# Altium project WiWi_USBStick.PrjPcb (part 4 of 5)

## Sheet 16-ECP5_FPGA_1.SchDoc
size C; SheetNumber: 11; SheetTotal: 14
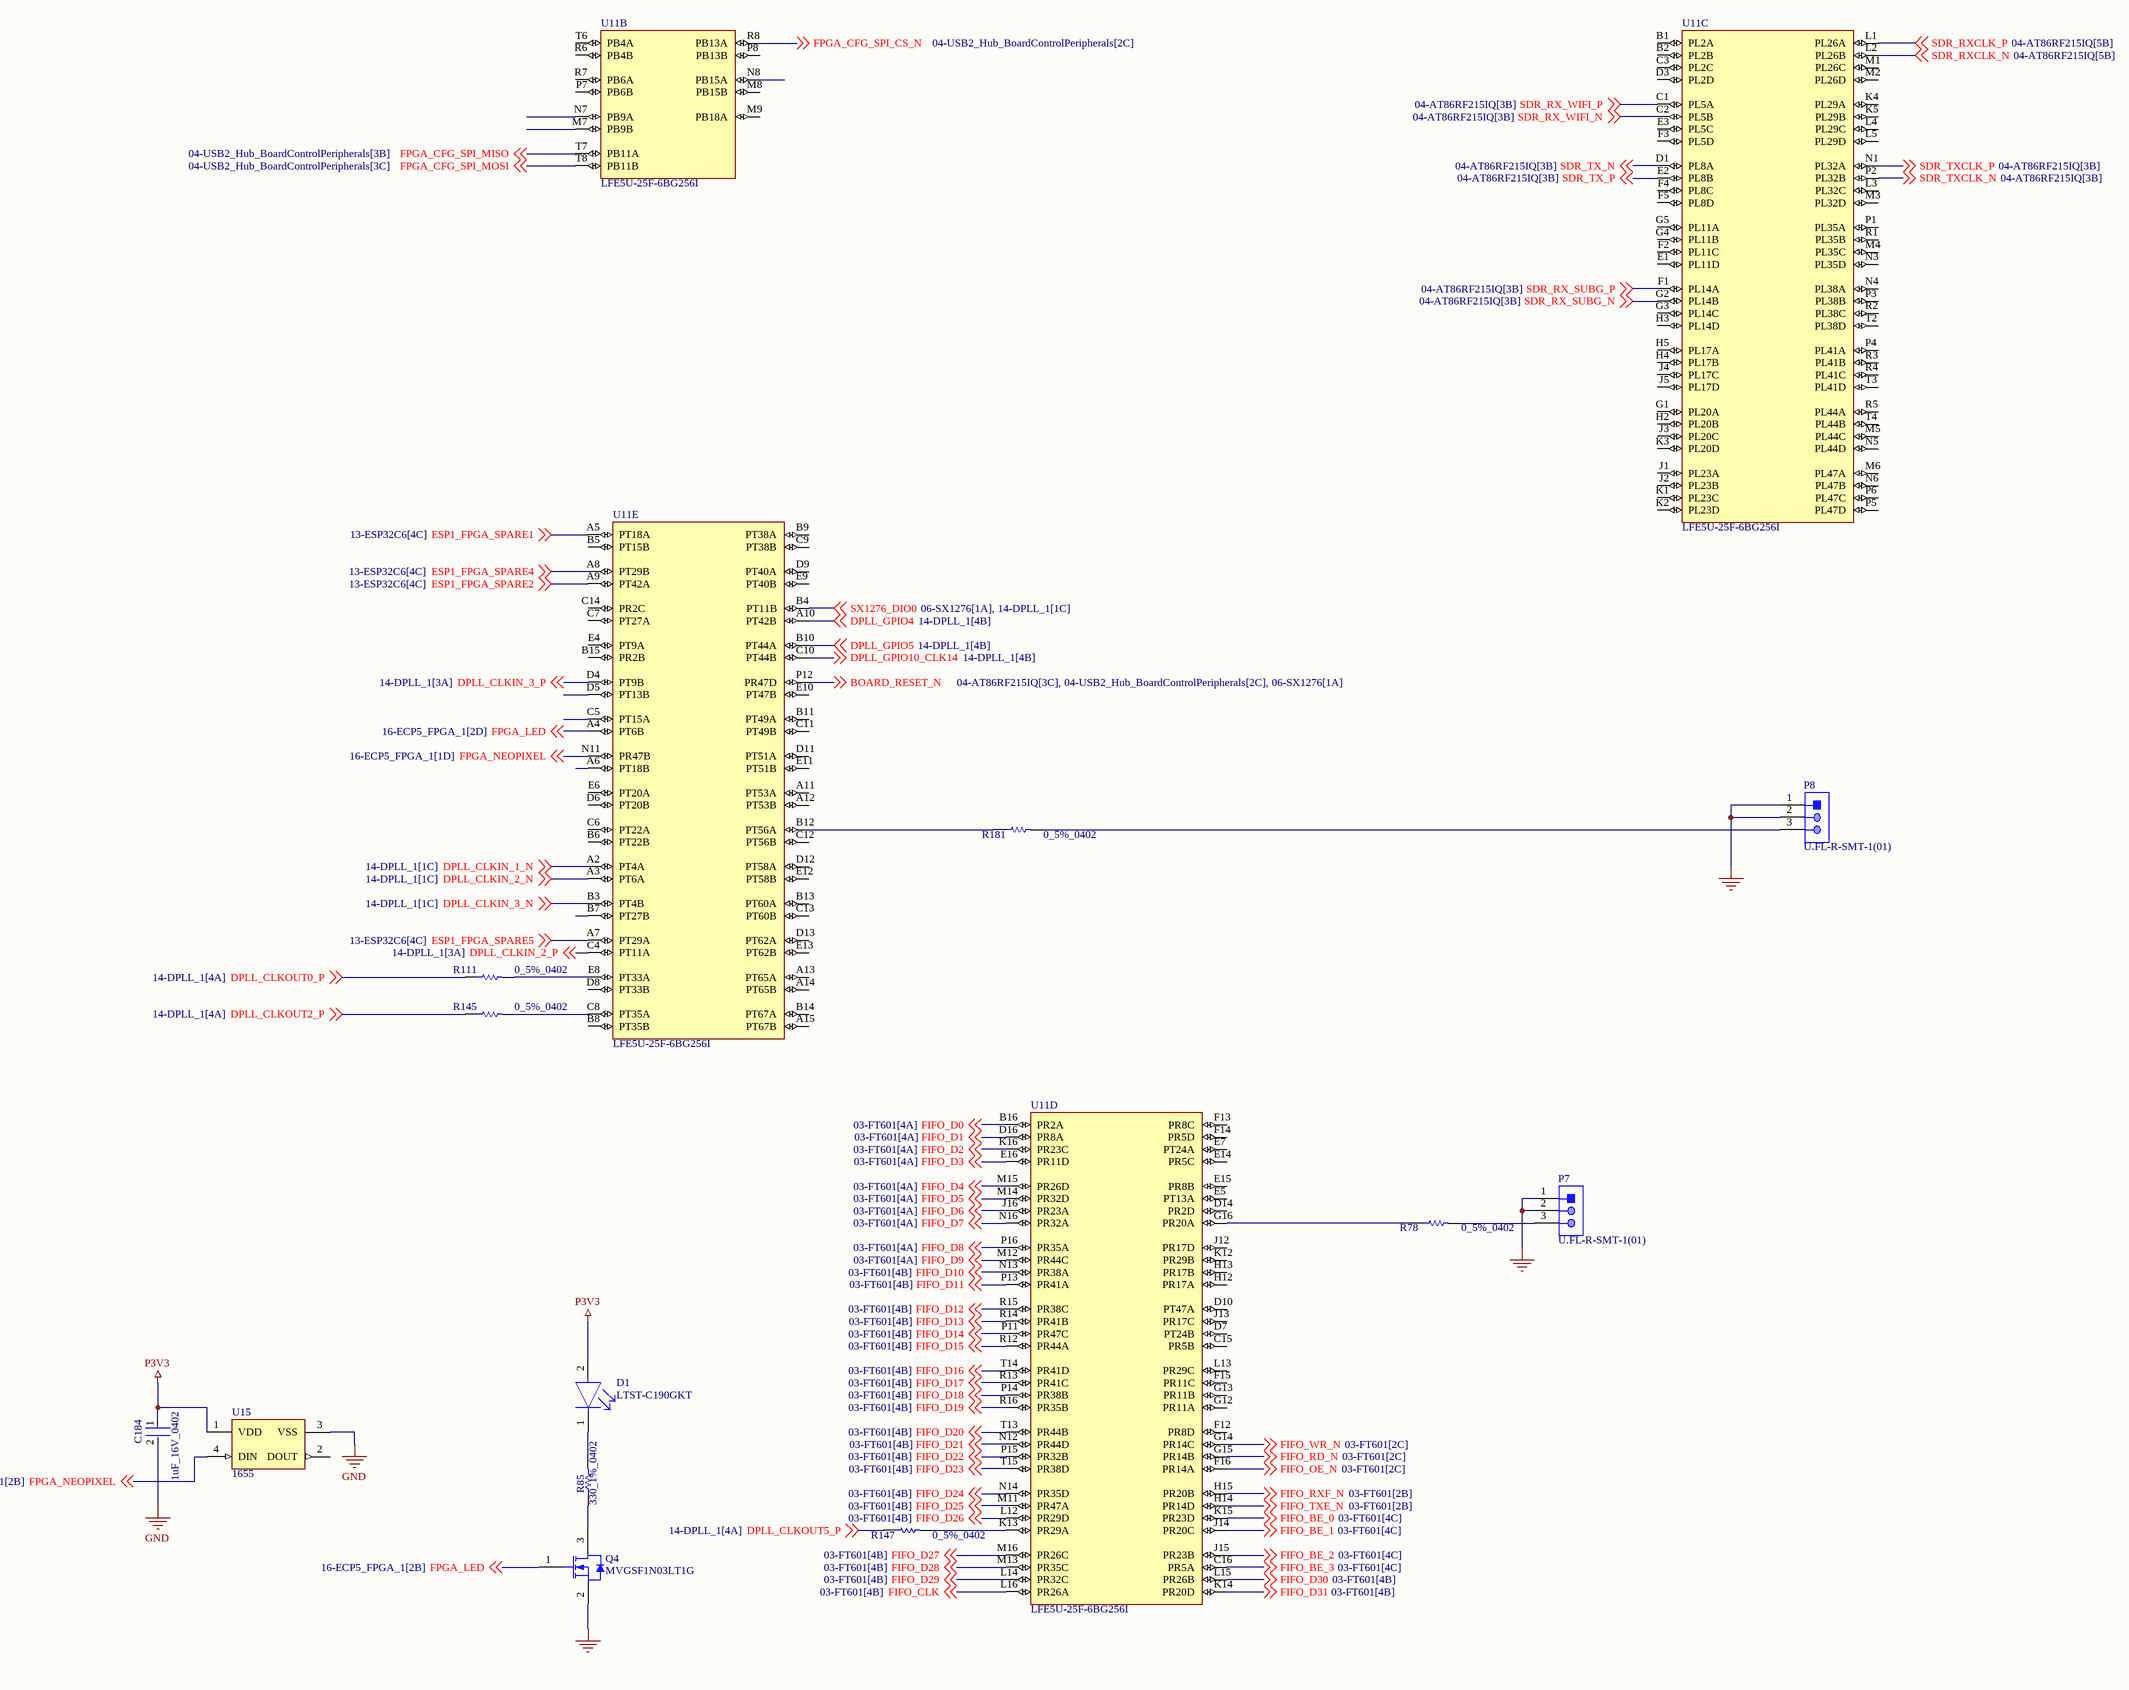
[diagram p10: 16-ECP5_FPGA_1.SchDoc]

### Parts
C184  1uF_16V_0402  [FP-0402-L_1_0_0_05-W_0_5-IPC_A]
D1  LTST-C190GKT  [FP-LTST-C190GKT-MFG]
P7  U.FL-R-SMT-1(01)  [HRS-U.FL-R-SMT-3_V]
P8  U.FL-R-SMT-1(01)  [HRS-U.FL-R-SMT-3_V]
Q4  MVGSF1N03LT1G  [ONSC-SOT-23-3-318-08_V]
R78  0_5%_0402  [RESC1005X40X25NL05T10]
R85  330_1%_0402  [RESC1005X40X25NL10T10]
R111  0_5%_0402  [RESC1005X40X25NL05T10]
R145  0_5%_0402  [RESC1005X40X25NL05T10]
R147  0_5%_0402  [RESC1005X40X25NL05T10]
R181  0_5%_0402  [RESC1005X40X25NL05T10]
U11  LFE5U-25F-6BG256I  [FP-LFE5U-25F-6BG256I-MFG]  (parts B,C,D,E of 5)
U15  1655  [ADA-RGB-1655_V]

### Nets
GND: C184.2 P7.1 P7.2 P8.1 P8.2 Q4.2(S) U15.3(VSS)
P3V3: C184.1 D1.2(A) U15.1(VDD)
BOARD_RESET_N: U11.P12(PR47D) ; off-sheet BOARD_RESET_N
DPLL_CLKIN_1_N: U11.A2(PT4A) ; off-sheet DPLL_CLKIN_1_N
DPLL_CLKIN_2_N: U11.A3(PT6A) ; off-sheet DPLL_CLKIN_2_N
DPLL_CLKIN_2_P: U11.C4(PT11A) ; off-sheet DPLL_CLKIN_2_P
DPLL_CLKIN_3_N: U11.B3(PT4B) ; off-sheet DPLL_CLKIN_3_N
DPLL_CLKIN_3_P: U11.D4(PT9B) ; off-sheet DPLL_CLKIN_3_P
DPLL_CLKOUT0_P: R111.1 ; off-sheet DPLL_CLKOUT0_P
DPLL_CLKOUT2_P: R145.1 ; off-sheet DPLL_CLKOUT2_P
DPLL_CLKOUT5_P: R147.1 ; off-sheet DPLL_CLKOUT5_P
DPLL_GPIO4: U11.A10(PT42B) ; off-sheet DPLL_GPIO4
DPLL_GPIO5: U11.B10(PT44A) ; off-sheet DPLL_GPIO5
DPLL_GPIO10_CLK14: U11.C10(PT44B) ; off-sheet DPLL_GPIO10_CLK14
ESP1_FPGA_SPARE1: U11.A5(PT18A) ; off-sheet ESP1_FPGA_SPARE1
ESP1_FPGA_SPARE2: U11.A9(PT42A) ; off-sheet ESP1_FPGA_SPARE2
ESP1_FPGA_SPARE4: U11.A8(PT29B) ; off-sheet ESP1_FPGA_SPARE4
ESP1_FPGA_SPARE5: U11.A7(PT29A) ; off-sheet ESP1_FPGA_SPARE5
FIFO_BE_0: U11.K15(PR23D) ; off-sheet FIFO_BE_0
FIFO_BE_1: U11.J14(PR20C) ; off-sheet FIFO_BE_1
FIFO_BE_2: U11.J15(PR23B) ; off-sheet FIFO_BE_2
FIFO_BE_3: U11.C16(PR5A) ; off-sheet FIFO_BE_3
FIFO_CLK: U11.L16(PR26A) ; off-sheet FIFO_CLK
FIFO_D0: U11.B16(PR2A) ; off-sheet FIFO_D0
FIFO_D1: U11.D16(PR8A) ; off-sheet FIFO_D1
FIFO_D2: U11.K16(PR23C) ; off-sheet FIFO_D2
FIFO_D3: U11.E16(PR11D) ; off-sheet FIFO_D3
FIFO_D4: U11.M15(PR26D) ; off-sheet FIFO_D4
FIFO_D5: U11.M14(PR32D) ; off-sheet FIFO_D5
FIFO_D6: U11.J16(PR23A) ; off-sheet FIFO_D6
FIFO_D7: U11.N16(PR32A) ; off-sheet FIFO_D7
FIFO_D8: U11.P16(PR35A) ; off-sheet FIFO_D8
FIFO_D9: U11.M12(PR44C) ; off-sheet FIFO_D9
FIFO_D10: U11.N13(PR38A) ; off-sheet FIFO_D10
FIFO_D11: U11.P13(PR41A) ; off-sheet FIFO_D11
FIFO_D12: U11.R15(PR38C) ; off-sheet FIFO_D12
FIFO_D13: U11.R14(PR41B) ; off-sheet FIFO_D13
FIFO_D14: U11.P11(PR47C) ; off-sheet FIFO_D14
FIFO_D15: U11.R12(PR44A) ; off-sheet FIFO_D15
FIFO_D16: U11.T14(PR41D) ; off-sheet FIFO_D16
FIFO_D17: U11.R13(PR41C) ; off-sheet FIFO_D17
FIFO_D18: U11.P14(PR38B) ; off-sheet FIFO_D18
FIFO_D19: U11.R16(PR35B) ; off-sheet FIFO_D19
FIFO_D20: U11.T13(PR44B) ; off-sheet FIFO_D20
FIFO_D21: U11.N12(PR44D) ; off-sheet FIFO_D21
FIFO_D22: U11.P15(PR32B) ; off-sheet FIFO_D22
FIFO_D23: U11.T15(PR38D) ; off-sheet FIFO_D23
FIFO_D24: U11.N14(PR35D) ; off-sheet FIFO_D24
FIFO_D25: U11.M11(PR47A) ; off-sheet FIFO_D25
FIFO_D26: U11.L12(PR29D) ; off-sheet FIFO_D26
FIFO_D27: U11.M16(PR26C) ; off-sheet FIFO_D27
FIFO_D28: U11.M13(PR35C) ; off-sheet FIFO_D28
FIFO_D29: U11.L14(PR32C) ; off-sheet FIFO_D29
FIFO_D30: U11.L15(PR26B) ; off-sheet FIFO_D30
FIFO_D31: U11.K14(PR20D) ; off-sheet FIFO_D31
FIFO_OE_N: U11.F16(PR14A) ; off-sheet FIFO_OE_N
FIFO_RD_N: U11.G15(PR14B) ; off-sheet FIFO_RD_N
FIFO_RXF_N: U11.H15(PR20B) ; off-sheet FIFO_RXF_N
FIFO_TXE_N: U11.H14(PR14D) ; off-sheet FIFO_TXE_N
FIFO_WR_N: U11.G14(PR14C) ; off-sheet FIFO_WR_N
FPGA_CFG_SPI_CS_N: U11.R8(PB13A) ; off-sheet FPGA_CFG_SPI_CS_N
FPGA_CFG_SPI_MISO: U11.T7(PB11A) ; off-sheet FPGA_CFG_SPI_MISO
FPGA_CFG_SPI_MOSI: U11.T8(PB11B) ; off-sheet FPGA_CFG_SPI_MOSI
FPGA_LED: Q4.1(G) U11.A4(PT6B) ; off-sheet FPGA_LED
FPGA_NEOPIXEL: U11.N11(PR47B) U15.4(DIN) ; off-sheet FPGA_NEOPIXEL
SDR_RX_SUBG_N: U11.G2(PL14B) ; off-sheet SDR_RX_SUBG_N
SDR_RX_SUBG_P: U11.F1(PL14A) ; off-sheet SDR_RX_SUBG_P
SDR_RX_WIFI_N: U11.C2(PL5B) ; off-sheet SDR_RX_WIFI_N
SDR_RX_WIFI_P: U11.C1(PL5A) ; off-sheet SDR_RX_WIFI_P
SDR_RXCLK_N: U11.L2(PL26B) ; off-sheet SDR_RXCLK_N
SDR_RXCLK_P: U11.L1(PL26A) ; off-sheet SDR_RXCLK_P
SDR_TX_N: U11.D1(PL8A) ; off-sheet SDR_TX_N
SDR_TX_P: U11.E2(PL8B) ; off-sheet SDR_TX_P
SDR_TXCLK_N: U11.P2(PL32B) ; off-sheet SDR_TXCLK_N
SDR_TXCLK_P: U11.N1(PL32A) ; off-sheet SDR_TXCLK_P
SX1276_DIO0: U11.B4(PT11B) ; off-sheet SX1276_DIO0
NetD1_1: D1.1(C) R85.2
NetP7_3: P7.3 R78.2
NetP8_3: P8.3 R181.2
NetQ4_3: Q4.3(D) R85.1
NetR78_1: R78.1 U11.G16(PR20A)
NetR111_2: R111.2 U11.E8(PT33A)
NetR145_2: R145.2 U11.C8(PT35A)
NetR147_2: R147.2 U11.K13(PR29A)
NetR181_1: R181.1 U11.B12(PT56A)

Not connected (* = marked no-connect by the designer): U11 A6(PT18B) A11(PT53A) A12(PT53B) A13(PT65A) A14(PT65B) A15(PT67B) B1(PL2A) B2(PL2B) B5(PT15B) B6(PT22B) B7(PT27B) B8(PT35B) B9(PT38A) B11(PT49A) B13(PT60A) B14(PT67A) B15(PR2B) C3(PL2C) C5(PT15A) C6(PT22A) C7(PT27A) C9(PT38B) C11(PT49B) C12(PT56B) C13(PT60B) C14(PR2C) C15(PR5B) D3(PL2D) D5(PT13B) D6(PT20B) D7(PT24B) D8(PT33B) D9(PT40A) D10(PT47A) D11(PT51A) D12(PT58A) D13(PT62A) D14(PR2D) E1(PL11D) E3(PL5C) E4(PT9A) E5(PT13A) E6(PT20A) E7(PT24A) E9(PT40B) E10(PT47B) E11(PT51B) E12(PT58B) E13(PT62B) E14(PR5C) E15(PR8B) F2(PL11C) F3(PL5D) F4(PL8C) F5(PL8D) F12(PR8D) F13(PR8C) F14(PR5D) F15(PR11C) G1(PL20A) G3(PL14C) G4(PL11B) G5(PL11A) G12(PR11A) G13(PR11B) H2(PL20B) H3(PL14D) H4(PL17B) H5(PL17A) H12(PR17A) H13(PR17B) J1(PL23A) J2(PL23B) J3(PL20C) J4(PL17C) J5(PL17D) J12(PR17D) J13(PR17C) K1(PL23C) K2(PL23D) K3(PL20D) K4(PL29A) K5(PL29B) K12(PR29B) L3(PL32C) L4(PL29C) L5(PL29D) L13(PR29C) M1(PL26C) M2(PL26D) M3(PL32D) M4(PL35C) M5(PL44C) M6(PL47A) M7(PB9B) M8(PB15B) M9(PB18A) N3(PL35D) N4(PL38A) N5(PL44D) N6(PL47B) N7(PB9A) N8(PB15A) P1(PL35A) P3(PL38B) P4(PL41A) P5(PL47D) P6(PL47C) P7(PB6B) P8(PB13B) R1(PL35B) R2(PL38C) R3(PL41B) R4(PL41C) R5(PL44A) R6(PB4B) R7(PB6A) T2(PL38D) T3(PL41D) T4(PL44B) T6(PB4A); U15 2(DOUT)

### Library data of the parts
C184 = CMP-14477-000104-2: as C301 on sheet 13-ESP32C6; Packaging: Tape and Reel; Depth: 0.5mm; Mount: Surface Mount; Thickness: 0.022inch; Package Quantity: 1; Min Operating Temperature: -55°C; Series: M; Voltage Rating (DC): 16V; Termination: SMD/SMT; Case/Package: 0402; Number of Pins: 2; Case Code (Imperial): 0402; Length: 1mm; Halogen Free: Halogen Free; Case Code (Metric): 1005; Width: 0.02inch; RoHS Compliant: Yes; Radiation Hardening: No; Max Operating Temperature: 85°C; Height: 0.5mm; Construction: Flat
D1 = CMP-22017-000005-2: as D4 on sheet 14-DPLL_1; Min Operating Temperature: -55°C; Lens Style: Clear; Mount: Surface Mount; Width: 0.8mm; Packaging: Tape and Reel; Lens Transparency: Clear; Case Code (Metric): 1608; Depth: 0.8mm; Case Code (Imperial): 0603; Case/Package: 0603; Number of Pins: 2; Max Operating Temperature: 85°C; Lead Free: Lead Free; Number of Elements: 1; Length: 1.6mm; Height: 0.8mm; Package Quantity: 1; Power Rating: 100mW; Radiation Hardening: No; Illumination Color: Green; Color: Green
P7 P8 = CMP-2000-05153-1: Ultra Small Coaxial Connector, 6 GHz, -40 to 90 degC, 3-Pin SMD, RoHS, Bulk; Manufacturer: Hirose Electric; Connector Style: U.FL; Impedance: 50Ohm; Dielectric Material: LiquidCrystalPolymer(LCP); Minimum Quantity: UltraMiniatureCoaxial; Online Catalog: U.FLSeries; Featured Product: HiroseU.FLSeries; Frequency - Max: 6GHz; Other Names: H122041 / U.FL-R-SMT-1(01)-ND; Contact Termination: Solder; Body Material: PhosphorBronze; Connector Type: Jack,MalePin; Body Finish: Silver; Center Contact Plating: Gold; Manufacturer URL: https://www.hirose.com; Family: CoaxialConnectors(RF); Fastening Type: Snap-On; Unit PriceUSD: U.FL; Series: U.FL; Package Reference: U.FL-R-SMT; Packaging: Bulk; Standard Package: 100; Mounting Type: SurfaceMount; Quantity Available: Bulk; Housing Color: Silver; Package Description: 3-Pin Surface Mount Device, Body 2.6 x 2.6 mm; Category: Connectors,Interconnects; Operating Temperature: -40degC~90degC; Center Contact Material: PhosphorBronze; Dynamic Catalog: U.FLSeries; Datasheet URL: https://datasheet.ciiva.com/26945/getdatasheetpartid-475239-26945414.pdf; Datasheet Version: Feb-09; Shield Termination: Solder
Q4 = CMP-1058-00779-1: Power MOSFET, 30 V, 2.1 A, Single N-Channel, 3-Pin SOT-23, Pb-Free, Tape and Reel; Manufacturer: On Semiconductor; V(BR)DSS Min (V): 30; VGS(th) Max (V): 2.4; Ciss Typ (pF): 140; VGS Max (V): 20; Channel Polarity: N Channel; ID Max (A): 2.1; Coss Typ (pF): 100; Crss Typ (pF): 40; ComponentLink3URL: http://www.onsemi.cn/pub_link/Collateral/318-08.PDF; Configuration: Single; PackageDescription: 3-Pin Small Outline Transistor, Body 2.92 x 1.3 mm, Pitch 0.95 mm; Packing: Tape and Reel; PartNumber: MVGSF1N03LT1G; ComponentLink2URL: http://www.onsemi.cn/pub_link/Collateral/MGSF1N03LT1-D.PDF; PackageVersion: Rev. AP, 11/2009; ComponentLink3Description: Package Specification; Package Type: SOT-23-3; ComponentLink1Description: Manufacturer URL; DatasheetVersion: Rev. 10; PackageReference: SOT-23-3-318-08; ComponentLink2Description: Datasheet; ComponentLink1URL: http://www.onsemi.com/; RoHS: Pb-Free; Mounting Technology: Surface Mount
R78 R111 R145 R147 R181 = CMP-2002-06457-1: as R137-R141 on sheet 13-ESP32C6
R85 = CMP-2002-05853-1: as R182 on sheet 14-DPLL_1
U11 = CMP-17932-000009-1: IC FPGA 197 I/O 256CABGA; RAM Size: 1032192b; Number of Logic Elements/Cells: 24000; Number of Logic Blocks (LABs): 6000; Number of I/Os: 197; Number of Pins: 256; Mount: Surface Mount; Max Operating Temperature: 100°C; RoHS Compliant: Yes; Min Operating Temperature: -40°C
U15 = CMP-2000-05026-1: as U27 on sheet 13-ESP32C6; Datasheet URL: http://datasheet.octopart.com/ADA1655-Adafruit-Industries-datasheet-32028139.pdf; Series: Neopixel; Interface: -; Package Description: 4-Pin Surface Mount Device, Body 5 x 5 mm; Color: Red,Green,Blue(RGB); Category: Optoelectronics; Controller Type: -; Package Reference: 1655; Manufacturer URL: https://www.adafruit.com/; Mounting Type: SurfaceMount; Datasheet Version: May-13; Size / Dimension: 5.00mmLx5.00mmW; Family: Addressable,Specialty

## Sheet 17-ECP5_FPGA_2.SchDoc
size B; SheetNumber: 12; SheetTotal: 14
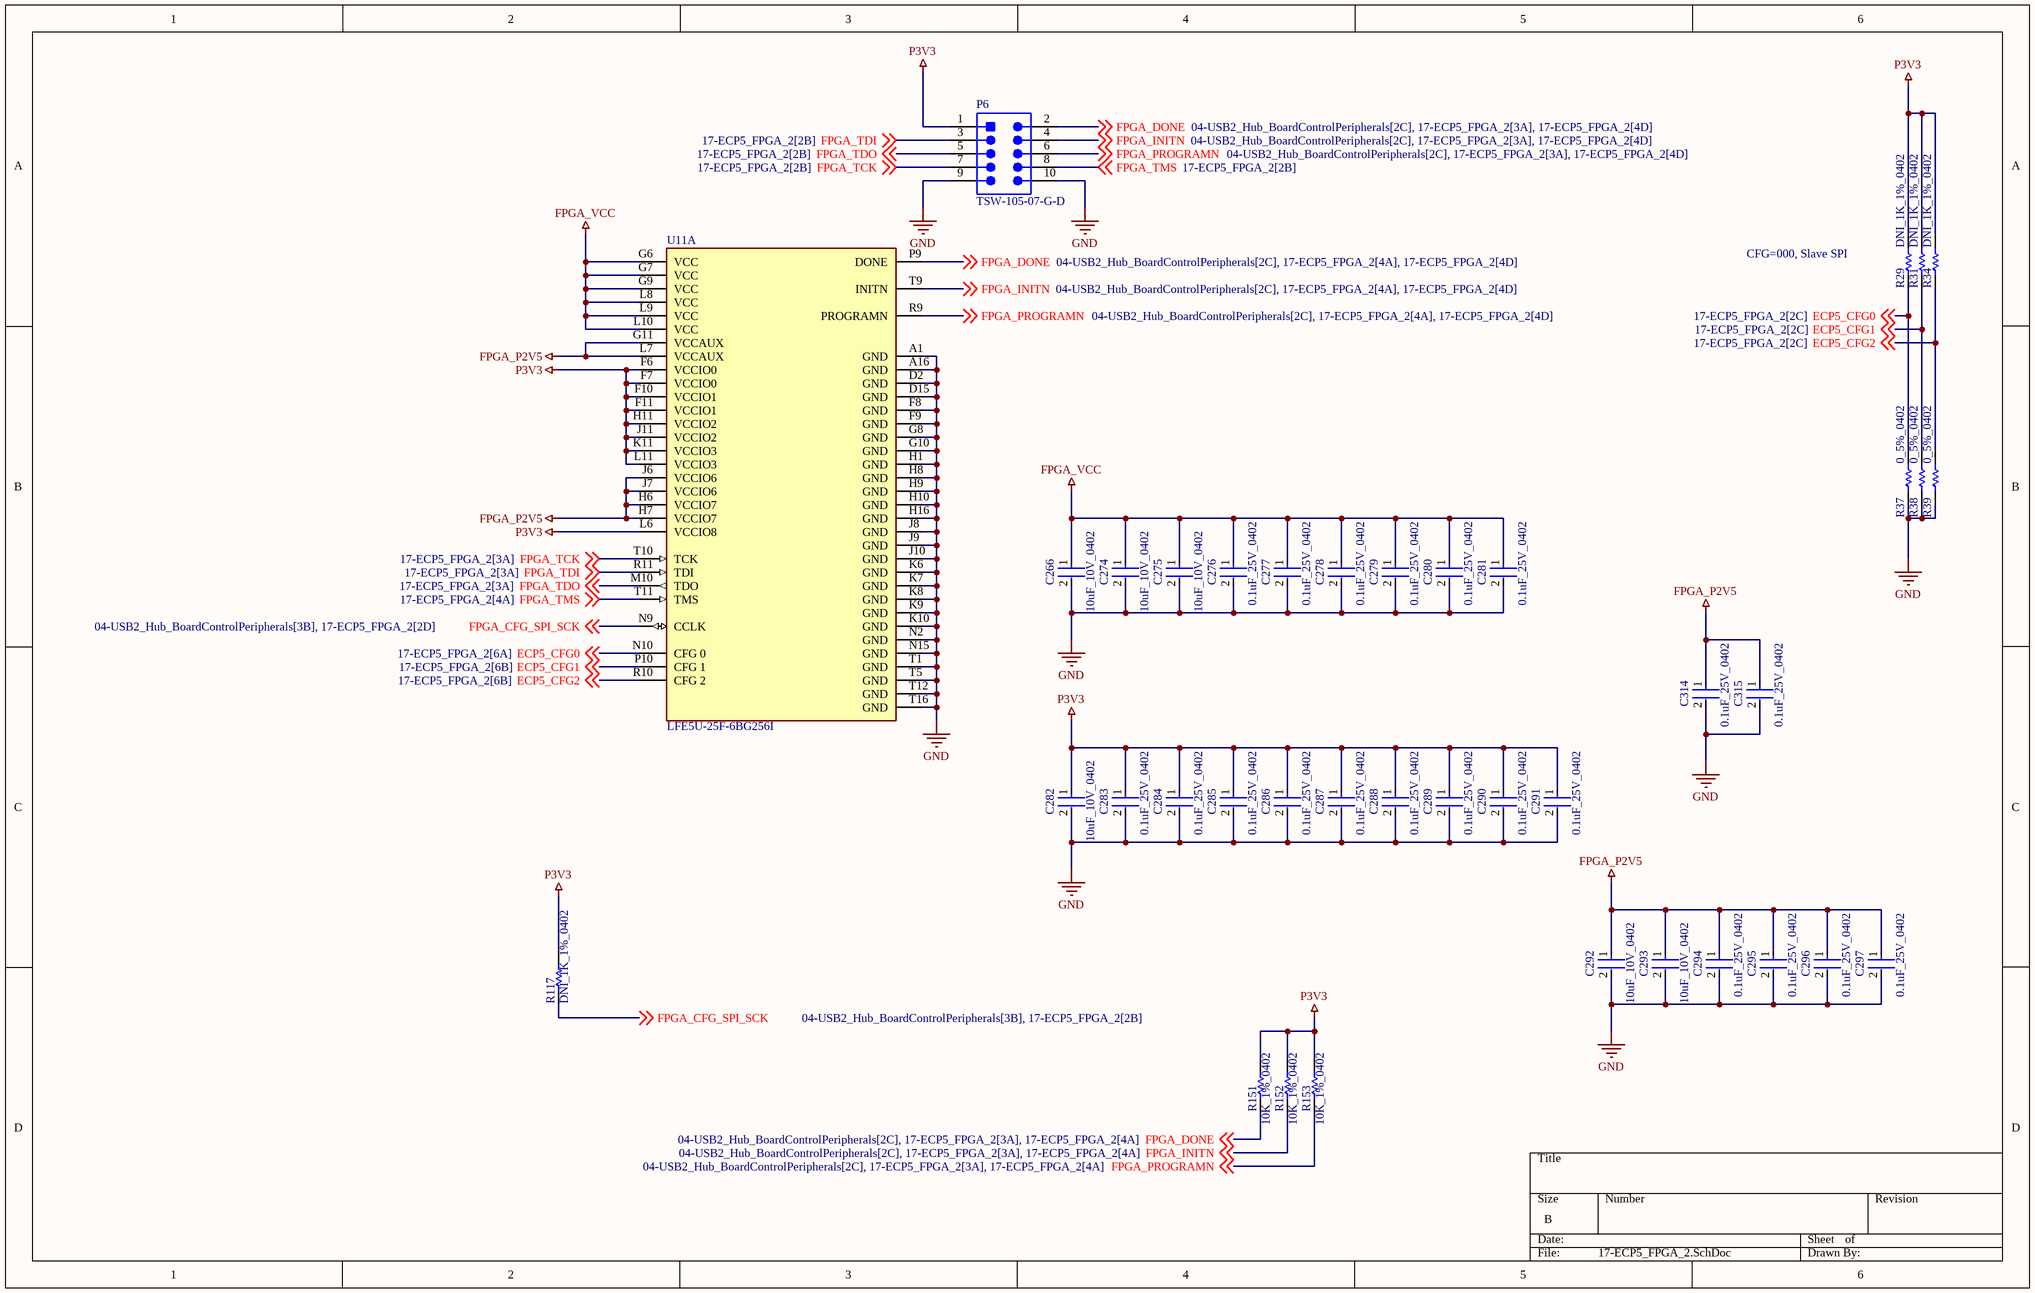
[diagram p11: 17-ECP5_FPGA_2.SchDoc]

### Parts
C266  10uF_10V_0402  [FP-CL05A106MP5NUNC-MFG]
C274  10uF_10V_0402  [FP-CL05A106MP5NUNC-MFG]
C275  10uF_10V_0402  [FP-CL05A106MP5NUNC-MFG]
C276  0.1uF_25V_0402  [FP-0402-L_1_0_1-W_0_5_0_1-IPC_C]
C277  0.1uF_25V_0402  [FP-0402-L_1_0_1-W_0_5_0_1-IPC_C]
C278  0.1uF_25V_0402  [FP-0402-L_1_0_1-W_0_5_0_1-IPC_C]
C279  0.1uF_25V_0402  [FP-0402-L_1_0_1-W_0_5_0_1-IPC_C]
C280  0.1uF_25V_0402  [FP-0402-L_1_0_1-W_0_5_0_1-IPC_C]
C281  0.1uF_25V_0402  [FP-0402-L_1_0_1-W_0_5_0_1-IPC_C]
C282  10uF_10V_0402  [FP-CL05A106MP5NUNC-MFG]
C283  0.1uF_25V_0402  [FP-0402-L_1_0_1-W_0_5_0_1-IPC_C]
C284  0.1uF_25V_0402  [FP-0402-L_1_0_1-W_0_5_0_1-IPC_C]
C285  0.1uF_25V_0402  [FP-0402-L_1_0_1-W_0_5_0_1-IPC_C]
C286  0.1uF_25V_0402  [FP-0402-L_1_0_1-W_0_5_0_1-IPC_C]
C287  0.1uF_25V_0402  [FP-0402-L_1_0_1-W_0_5_0_1-IPC_C]
C288  0.1uF_25V_0402  [FP-0402-L_1_0_1-W_0_5_0_1-IPC_C]
C289  0.1uF_25V_0402  [FP-0402-L_1_0_1-W_0_5_0_1-IPC_C]
C290  0.1uF_25V_0402  [FP-0402-L_1_0_1-W_0_5_0_1-IPC_C]
C291  0.1uF_25V_0402  [FP-0402-L_1_0_1-W_0_5_0_1-IPC_C]
C292  10uF_10V_0402  [FP-CL05A106MP5NUNC-MFG]
C293  10uF_10V_0402  [FP-CL05A106MP5NUNC-MFG]
C294  0.1uF_25V_0402  [FP-0402-L_1_0_1-W_0_5_0_1-IPC_C]
C295  0.1uF_25V_0402  [FP-0402-L_1_0_1-W_0_5_0_1-IPC_C]
C296  0.1uF_25V_0402  [FP-0402-L_1_0_1-W_0_5_0_1-IPC_C]
C297  0.1uF_25V_0402  [FP-0402-L_1_0_1-W_0_5_0_1-IPC_C]
C314  0.1uF_25V_0402  [FP-0402-L_1_0_1-W_0_5_0_1-IPC_C]
C315  0.1uF_25V_0402  [FP-0402-L_1_0_1-W_0_5_0_1-IPC_C]
P6  TSW-105-07-G-D  [SMTC-TSW-105-07-G-D_V]
R29  DNI_1K_1%_0402  [RESC1005X40X25LL05T10]  (no BOM)
R31  DNI_1K_1%_0402  [RESC1005X40X25LL05T10]  (no BOM)
R34  DNI_1K_1%_0402  [RESC1005X40X25LL05T10]  (no BOM)
R37  0_5%_0402  [RESC1005X40X25LL10T10]
R38  0_5%_0402  [RESC1005X40X25LL10T10]
R39  0_5%_0402  [RESC1005X40X25LL10T10]
R117  DNI_1K_1%_0402  [RESC1005X40X25LL05T10]  (no BOM)
R151  10K_1%_0402  [RESC1005X40X25NL10T10]
R152  10K_1%_0402  [RESC1005X40X25NL10T10]
R153  10K_1%_0402  [RESC1005X40X25NL10T10]
U11  LFE5U-25F-6BG256I  [FP-LFE5U-25F-6BG256I-MFG]  (part A of 5)

### Nets
FPGA_P2V5: C292.1 C293.1 C294.1 C295.1 C296.1 C297.1 C314.1 C315.1 U11.G11(VCCAUX) U11.H6(VCCIO7) U11.H7(VCCIO7) U11.J6(VCCIO6) U11.J7(VCCIO6) U11.L7(VCCAUX)
FPGA_VCC: C266.1 C274.1 C275.1 C276.1 C277.1 C278.1 C279.1 C280.1 C281.1 U11.G6(VCC) U11.G7(VCC) U11.G9(VCC) U11.L8(VCC) U11.L9(VCC) U11.L10(VCC)
GND: C266.2 C274.2 C275.2 C276.2 C277.2 C278.2 C279.2 C280.2 C281.2 C282.2 C283.2 C284.2 C285.2 C286.2 C287.2 C288.2 C289.2 C290.2 C291.2 C292.2 C293.2 C294.2 C295.2 C296.2 C297.2 C314.2 C315.2 P6.9 P6.10 R37.1 R38.1 R39.1 U11.A1(GND) U11.A16(GND) U11.D2(GND) U11.D15(GND) U11.F8(GND) U11.F9(GND) U11.G8(GND) U11.G10(GND) U11.H1(GND) U11.H8(GND) U11.H9(GND) U11.H10(GND) U11.H16(GND) U11.J8(GND) U11.J9(GND) U11.J10(GND) U11.K6(GND) U11.K7(GND) U11.K8(GND) U11.K9(GND) U11.K10(GND) U11.N2(GND) U11.N15(GND) U11.T1(GND) U11.T5(GND) U11.T12(GND) U11.T16(GND)
P3V3: C282.1 C283.1 C284.1 C285.1 C286.1 C287.1 C288.1 C289.1 C290.1 C291.1 P6.1 R29.2 R31.2 R34.2 R117.2 R151.2 R152.2 R153.2 U11.F6(VCCIO0) U11.F7(VCCIO0) U11.F10(VCCIO1) U11.F11(VCCIO1) U11.H11(VCCIO2) U11.J11(VCCIO2) U11.K11(VCCIO3) U11.L6(VCCIO8) U11.L11(VCCIO3)
ECP5_CFG0: R29.1 R37.2 U11.N10(CFG_0) ; off-sheet ECP5_CFG0
ECP5_CFG1: R31.1 R38.2 U11.P10(CFG_1) ; off-sheet ECP5_CFG1
ECP5_CFG2: R34.1 R39.2 U11.R10(CFG_2) ; off-sheet ECP5_CFG2
FPGA_CFG_SPI_SCK: R117.1 U11.N9(CCLK) ; off-sheet FPGA_CFG_SPI_SCK
FPGA_DONE: P6.2 R151.1 U11.P9(DONE) ; off-sheet FPGA_DONE
FPGA_INITN: P6.4 R152.1 U11.T9(INITN) ; off-sheet FPGA_INITN
FPGA_PROGRAMN: P6.6 R153.1 U11.R9(PROGRAMN) ; off-sheet FPGA_PROGRAMN
FPGA_TCK: P6.7 U11.T10(TCK) ; off-sheet FPGA_TCK
FPGA_TDI: P6.3 U11.R11(TDI) ; off-sheet FPGA_TDI
FPGA_TDO: P6.5 U11.M10(TDO) ; off-sheet FPGA_TDO
FPGA_TMS: P6.8 U11.T11(TMS) ; off-sheet FPGA_TMS

### Notes on the sheet
- CFG=000, Slave SPI

### Library data of the parts
C266 C274 C275 C282 C292 C293 = CMP-13271-000002-1: as C7 on sheet 14-DPLL_1; Octopart: https://octopart.com/cl05a106mp5nunc-samsung-22457395; Voltage Rating: 10V; RoHS: TRUE; Value: 10uF; Height: 0.7mm; Digikey Description: CAP CER 10UF 10V X5R 0402; Automotive: No; Package: CL05A106MP5NUNC; Device Class L1: Passive Components; Capacitance: 10uF; Temperature Range High: +85°C; ComponentLink2Description: Datasheet; Device Class L2: Capacitors; Temperature Characteristic: X5R; Temperature: -55°C to +85°C; ComponentLink2URL: http://www.samsungsem.com/kr/support/product-search/mlcc/__icsFiles/afieldfile/2019/05/10/19-CL05A106MP5NUNC.pdf; Device Class L3: Ceramic Capacitors; Category: Cap; Temperature Range Low: -55°C; Ipc Land Pattern Name: CAPC10050X50; Lead Free: Yes
C276-C281 C283-C291 C294-C297 C314 C315 = CMP-2008-02519-2: as C28 on sheet 14-DPLL_1; Package Quantity: 1; Capacitance: 100nF; Min Operating Temperature: -55°C; Voltage: 25V; Voltage Rating: 25V; Construction: Flat; Max Operating Temperature: 125°C; Radiation Hardening: No; Depth: 0.5mm; Thickness: 0.022inch; Voltage Rating (DC): 25V; Number of Pins: 2; Lead Free: Lead Free; Series: -; REACH SVHC: No SVHC; Length: 1mm; Dielectric: X7R; RoHS Compliant: Yes; Mount: Surface Mount; Packaging: Tape and Reel; Case/Package: 0402; Case Code (Imperial): 0402; Termination: SMD/SMT; Width: 0.02inch; Case Code (Metric): 1005; Tolerance: 10%
P6 = CMP-2000-07330-1: Post Terminal Strip Assembly, Pitch 2.54 mm, 2 x 5 Position, Height 8.58 mm, Tail Length 2.54 mm, -55 to 125 degC, RoHS, Bulk; Manufacturer: Samtec-Inc.; Connector Type: Header,Unshrouded; Number of Positions Loaded: All; Pitch: 0.100"(2.54mm); Number of Positions: 10; Package Reference: TSW-105-07-G-D; Mounting Technology: ThroughHole; Datasheet URL: http://suddendocs.samtec.com/prints/tsw-xxx-xx-xxx-x-xx-xxx-mkt.pdf; Termination: Solder; Packaging: Bulk; Number of Rows: 2; Contact Finish: Gold; Mounting Type: ThroughHole; Features: -; Color: Black; Category: Connectors,Interconnects; Family: RectangularConnectors-Headers,MalePins; Manufacturer URL: http://www.samtec.com/; Series: TSW; Fastening Type: -; Package URL: http://suddendocs.samtec.com/prints/tsw-xxx-xx-x-x-xx-xxx-footprint.pdf; Row Spacing: 0.100"(2.54mm); Contact Mating Length: 0.230"(5.84mm); Contact Finish Thickness: 10µin(0.25µm); Contact Type: MalePin; Package Description: Male Header, Pitch 2.54 mm, 2 x 5 Position, Height 8.58 mm, Tail Length 2.54 mm; Datasheet Version: Rev. DO, 08/1988
R29 R31 R34 R117 = CMP-2002-03045-1: Part Number: CRCW04021K00FKEDHP; Manufacturer: Vishay Dale
R37-R39 = CMP-2002-04569-1: as R25 on sheet 14-DPLL_1
R151-R153 = CMP-2002-04694-1: as R135 on sheet 13-ESP32C6
U11 = CMP-17932-000009-1: as U11 on sheet 16-ECP5_FPGA_1; Number of Pins: 256; Mount: Surface Mount; Max Operating Temperature: 100°C; RoHS Compliant: Yes; Min Operating Temperature: -40°C

## Sheet 11-Power.SchDoc
size B; SheetNumber: 13; SheetTotal: 14; SPICEModelCacheAVYIXNQT: <root> / <DocumentId>AVYIXNQT</DocumentId> / </root>
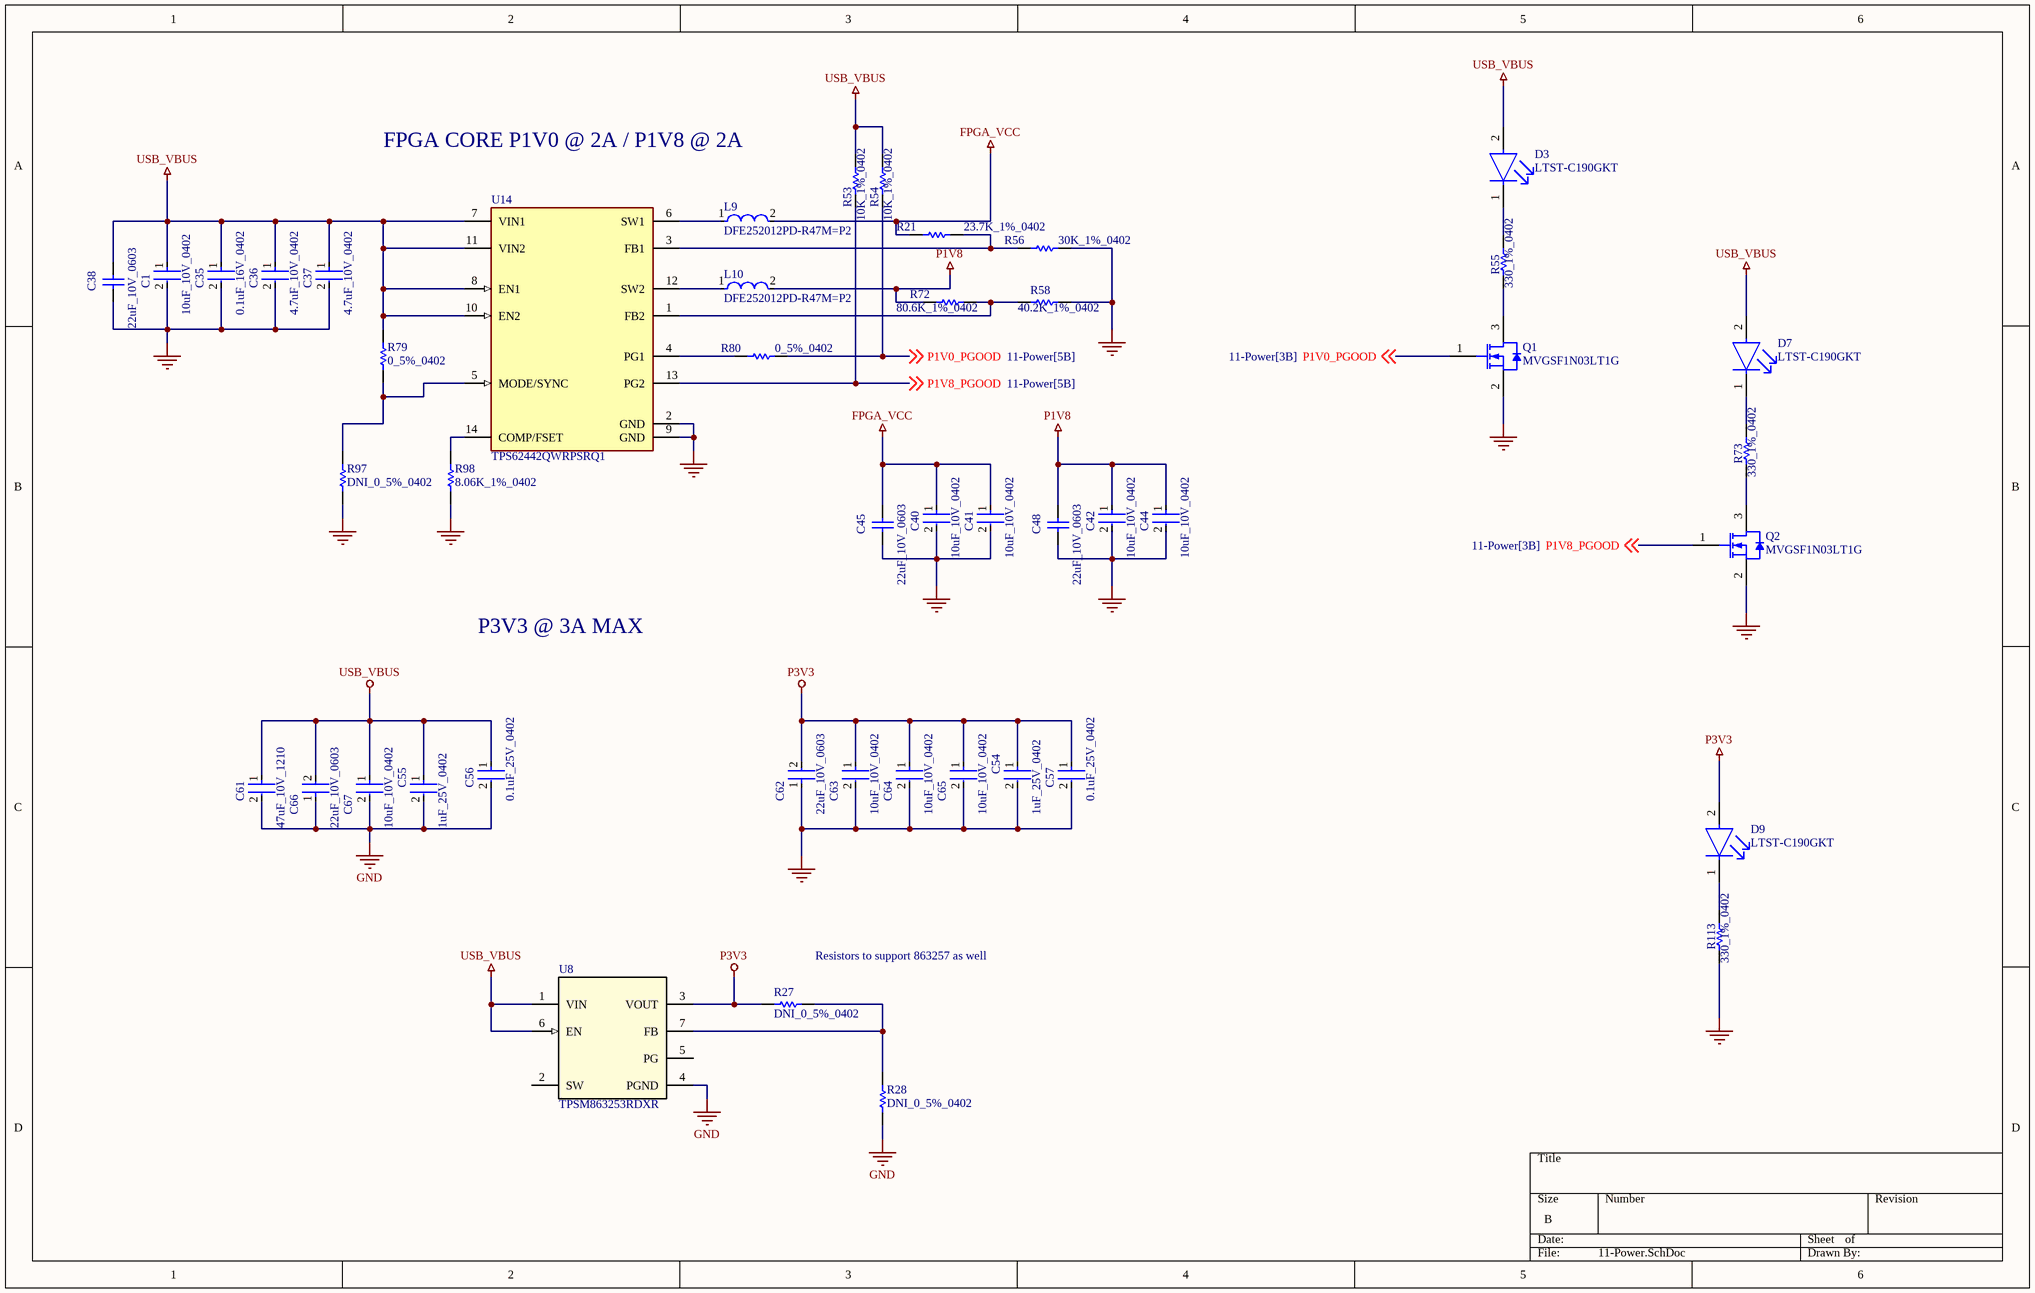
[diagram p12: 11-Power.SchDoc]

### Parts
C1  10uF_10V_0402  [FP-CL05A106MP5NUNC-MFG]
C35  0.1uF_16V_0402  [FP-C0402-BB-MFG]
C36  4.7uF_10V_0402  [FP-C1005-050-0_15-MFG]
C37  4.7uF_10V_0402  [FP-C1005-050-0_15-MFG]
C38  22uF_10V_0603  [CAPC1608X100X20ML10]
C40  10uF_10V_0402  [FP-CL05A106MP5NUNC-MFG]
C41  10uF_10V_0402  [FP-CL05A106MP5NUNC-MFG]
C42  10uF_10V_0402  [FP-CL05A106MP5NUNC-MFG]
C44  10uF_10V_0402  [FP-CL05A106MP5NUNC-MFG]
C45  22uF_10V_0603  [CAPC1608X100X20ML10]
C48  22uF_10V_0603  [CAPC1608X100X20ML10]
C54  1uF_25V_0402  [FP-C1005-050-0_05-IPC_B]
C55  1uF_25V_0402  [FP-C1005-050-0_05-IPC_B]
C56  0.1uF_25V_0402  [FP-0402-L_1_0_0_05-W_0_5-IPC_B]
C57  0.1uF_25V_0402  [FP-0402-L_1_0_0_05-W_0_5-IPC_B]
C61  47uF_10V_1210  [FP-MK325M-MFG]
C62  22uF_10V_0603  [FP-GRM188-0_2-IPC_C]
C63  10uF_10V_0402  [FP-CL05A106MP5NUNC-MFG]
C64  10uF_10V_0402  [FP-CL05A106MP5NUNC-MFG]
C65  10uF_10V_0402  [FP-CL05A106MP5NUNC-MFG]
C66  22uF_10V_0603  [FP-GRM188-0_2-IPC_C]
C67  10uF_10V_0402  [FP-CL05A106MP5NUNC-MFG]
D3  LTST-C190GKT  [FP-LTST-C190GKT-MFG]
D7  LTST-C190GKT  [FP-LTST-C190GKT-MFG]
D9  LTST-C190GKT  [FP-LTST-C190GKT-MFG]
L9  DFE252012PD-R47M=P2  [FP-DFE252012C-IPC_A]
L10  DFE252012PD-R47M=P2  [FP-DFE252012C-IPC_A]
Q1  MVGSF1N03LT1G  [ONSC-SOT-23-3-318-08_V]
Q2  MVGSF1N03LT1G  [ONSC-SOT-23-3-318-08_V]
R21  23.7K_1%_0402  [RESC1005X40X25ML05T05]
R27  DNI_0_5%_0402  [RESC1005X40X25NL05T10]  (no BOM)
R28  DNI_0_5%_0402  [RESC1005X40X25NL05T10]  (no BOM)
R53  10K_1%_0402  [RESC1005X40X25NL10T10]
R54  10K_1%_0402  [RESC1005X40X25NL10T10]
R55  330_1%_0402  [RESC1005X40X25NL10T10]
R56  30K_1%_0402  [RESC1005X40X25ML05T05]
R58  40.2K_1%_0402  [RESC1005X40X25ML05T10]
R72  80.6K_1%_0402  [RESC1005X40X25NL05T10]
R73  330_1%_0402  [RESC1005X40X25NL10T10]
R79  0_5%_0402  [RESC1005X40X25NL05T10]
R80  0_5%_0402  [RESC1005X40X25NL05T10]
R97  DNI_0_5%_0402  [RESC1005X40X25NL05T10]  (no BOM)
R98  8.06K_1%_0402  [RESC1005X40X25ML05T05]
R113  330_1%_0402  [RESC1005X40X25NL10T10]
U8  TPSM863253RDXR  [RDX0007A-MFG]
U14  TPS62442QWRPSRQ1  [FP-RQR0014A-MFG]

### Nets
FPGA_VCC: C40.1 C41.1 C45.2 L9.2 R21.1
GND: C1.2 C35.2 C36.2 C37.2 C38.1 C40.2 C41.2 C42.2 C44.2 C45.1 C48.1 C54.2 C55.2 C56.2 C57.2 C61.2 C62.1 C63.2 C64.2 C65.2 C66.1 C67.2 Q1.2(S) Q2.2(S) R28.2 R56.2 R58.2 R97.1 R98.1 R113.1 U8.4(PGND) U14.2(GND) U14.9(GND)
P1V8: C42.1 C44.1 C48.2 L10.2 R72.1
P3V3: C54.1 C57.1 C62.2 C63.1 C64.1 C65.1 D9.2(A) R27.2 U8.3(VOUT)
USB_VBUS: C1.1 C35.1 C36.1 C37.1 C38.2 C55.1 C56.1 C61.1 C66.2 C67.1 D3.2(A) D7.2(A) R53.2 R54.2 R79.2 U8.1(VIN) U8.6(EN) U14.7(VIN1) U14.8(EN1) U14.10(EN2) U14.11(VIN2)
P1V0_PGOOD: Q1.1(G) R54.1 R80.2 ; off-sheet P1V0_PGOOD
P1V8_PGOOD: Q2.1(G) R53.1 U14.13(PG2) ; off-sheet P1V8_PGOOD
NetD3_1: D3.1(C) R55.2
NetD7_1: D7.1(C) R73.2
NetD9_1: D9.1(C) R113.2
NetL9_1: L9.1 U14.6(SW1)
NetL10_1: L10.1 U14.12(SW2)
NetQ1_3: Q1.3(D) R55.1
NetQ2_3: Q2.3(D) R73.1
NetR21_2: R21.2 R56.1 U14.3(FB1)
NetR27_1: R27.1 R28.1 U8.7(FB)
NetR58_1: R58.1 R72.2 U14.1(FB2)
NetR79_1: R79.1 R97.2 U14.5(MODE/SYNC)
NetR80_1: R80.1 U14.4(PG1)
NetR98_2: R98.2 U14.14(COMP/FSET)

Not connected (* = marked no-connect by the designer): U8 2(SW) 5(PG)

### Notes on the sheet
- FPGA CORE P1V0 @ 2A / P1V8 @ 2A
- P3V3 @ 3A MAX
- (near R27) Resistors to support 863257 as well

### Library data of the parts
C1 C40-C42 C44 C63-C65 C67 = CMP-13271-000002-1: as C7 on sheet 14-DPLL_1; Octopart: https://octopart.com/cl05a106mp5nunc-samsung-22457395; Voltage Rating: 10V; RoHS: TRUE; Value: 10uF; Height: 0.7mm; Digikey Description: CAP CER 10UF 10V X5R 0402; Automotive: No; Package: CL05A106MP5NUNC; Device Class L1: Passive Components; Capacitance: 10uF; Temperature Range High: +85°C; ComponentLink2Description: Datasheet; Device Class L2: Capacitors; Temperature Characteristic: X5R; Temperature: -55°C to +85°C; ComponentLink2URL: http://www.samsungsem.com/kr/support/product-search/mlcc/__icsFiles/afieldfile/2019/05/10/19-CL05A106MP5NUNC.pdf; Device Class L3: Ceramic Capacitors; Category: Cap; Temperature Range Low: -55°C; Ipc Land Pattern Name: CAPC10050X50; Lead Free: Yes
C35 = CMP-1034-02068-3: as C300 on sheet 13-ESP32C6; ComponentLink2URL: https://content.kemet.com/datasheets/KEM_C1002_X7R_SMD.pdf; Automotive: No; Device Class L2: Capacitors; Temperature: -55°C to +125°C; RoHS: TRUE; Voltage Rating: 16 V; ComponentLink2Description: Datasheet; Device Class L3: Ceramic Capacitors; Temperature Range Low: -55°C; Ipc Land Pattern Name: CAPC10050X50; Device Class L1: Passive Components; Temperature Range High: +125°C; Package: C0402-BB; Capacitance: 0.10 μF; Category: Cap; Mouser Description: CAP CER 0.1UF 16V X7R 0402; Height: 0.55mm; Digikey Description: CAP CER 0.1UF 16V 5% X7R 0402; Octopart: https://octopart.com/c0402c104j4ractu-kemet-12573893; Temperature Characteristic: X7R; Lead Free: Yes
C36 C37 = CMP-2000-05997-2: CAP CER 4.7UF 10V X5R 0402; Dielectric Material: Ceramic; Tolerance: 10%; Series: C; Package Quantity: 10000; Max Operating Temperature: 85°C; Case Code (Imperial): 0402; Lead Free: Lead Free; Voltage Rating (DC): 10V; Packaging: Cut Tape; Voltage Rating: 10V; Min Operating Temperature: -55°C; Dielectric: X5R; Thickness: 0.022inch; Width: 0.02inch; Case/Package: 0402; Case Code (Metric): 1005; Capacitance: 4.7uF; Length: 0.039inch; RoHS Compliant: Yes; REACH SVHC: No SVHC; Mount: Surface Mount
C38 C45 C48 = CMP-2000-05441-1: Chip Capacitor, 22 uF, +/- 20%, 10 V, -55 to 85 degC, 0603 (1608 Metric), RoHS, Tape and Reel; Manufacturer: TDK; PCN Part Number: MLCCPartNumberChange30/Nov/2012; Voltage - Rated: 10V; Product Training Modules: CSeriesGeneralApplicationsSEAT,CCV,andTVCLDesignToolsGuidetoReplacinganElectrolyticCapacitorwithanMLCC; Other Names: 445-9077-1; Design Resources: 20WNon-IsolatedBuckLEDDriverUsingPLLNK460KG; Online Catalog: CSeries,GeneralPurpose; Capacitance: 22µF; Temperature Coefficient: X5R; Kits: 445-9014-KIT-ND-KITMLCC100PF-22UF060310-50V; Packaging: CutTape(CT); Standard Package: 1; Package / Case: 0603(1608Metric); Lead Style: -; Features: -; Ratings: -; Operating Temperature: -55degC~85degC; Applications: GeneralPurpose; Package Reference: 603; Datasheet URL: http://download.siliconexpert.com/pdfs/2015/4/21/15/54/45/779/tdk_/manual/37024850441143360mlcc_commercial_general_en.pdf; Datasheet Version: Mar-15; Mounting Type: SurfaceMount,MLCC; Lead Spacing: -; Size / Dimension: 0.063"Lx0.031"W(1.60mmx0.80mm); Height - Seated (Max): -; Package Description: 2-Pin Surface Mount Device, Body 1.6 x 0.8 mm; Manufacturer URL: http://www.tdk.com/; RoHS Information: RoHSCertificate-MLCC; Tolerance: ±20%; Series: C; Thickness (Max): 0.035"(0.90mm); Family: CeramicCapacitors; Category: Capacitors
C54 C55 = CMP-2000-06001-2: Multilayer Ceramic Capacitors 1μF ±10% 25V X5R SMD 0402; Capacitance: 1uF; Package Quantity: 1; Radiation Hardening: No; Dielectric: X5R; REACH SVHC: No SVHC; RoHS Compliant: Yes; Case Code (Imperial): 0402; Voltage Rating: 25V; Termination: SMD/SMT; Max Operating Temperature: 85°C; Series: C; Packaging: Tape and Reel; Tolerance: 10%; Voltage Rating (DC): 25V; Weight: 2.3E-05oz; Height: 0.5mm; Resistor Type: Ceramic; Thickness: 0.022inch; Min Operating Temperature: -55°C; Length: 1mm; Lead Free: Lead Free; Depth: 0.5mm; Dielectric Material: Ceramic; Width: 0.02inch; Case/Package: 0402; Case Code (Metric): 1005; Mount: Surface Mount
C56 C57 = CMP-14477-000014-3: None; Voltage Rating (DC): 25V; Tolerance: 10%; Capacitance: 100nF; Dielectric: X5R; Max Operating Temperature: 85°C; Resistor Type: Ceramic; Packaging: Tape and Reel; Lead Free: Lead Free; Case Code (Imperial): 0402; Thickness: 0.022inch; Series: M; Construction: Flat; Number of Pins: 2; Width: 0.5mm; Halogen Free: Halogen Free; Case/Package: 0402; Voltage: 25V; Height: 0.5mm; Mount: Surface Mount; Min Operating Temperature: -55°C; Case Code (Metric): 1005; Length: 1mm; Depth: 0.5mm; Voltage Rating: 25V; Package Quantity: 1; Weight: 2.3E-05oz; RoHS Compliant: Yes; Termination: SMD/SMT; REACH SVHC: No SVHC
C61 = CMP-2000-06559-2: CAP CER 47UF 10V X7R 1210; Tolerance: 20%; Packaging: Tape and Reel; Length: 3.2mm; Height: 2.5mm; Case Code (Metric): 3225; Min Operating Temperature: -55°C; Package Quantity: 500; Halogen Free: Halogen Free; Voltage Rating: 10V; Resistor Type: Ceramic; Capacitance: 47uF; Termination: SMD/SMT; Number of Pins: 2; Lead Free: Lead Free; Voltage Rating (DC): 10V; Width: 2.5mm; Case/Package: 1210; Dielectric: X7R; Mount: Surface Mount; Max Operating Temperature: 125°C; Construction: Flat; Case Code (Imperial): 1210; RoHS Compliant: Yes; Depth: 2.5mm; Thickness: 0.106inch; Voltage: 10V; Series: M; Radiation Hardening: No
C62 C66 = CMP-2000-06337-3: Chip Multilayer Ceramic Capacitors for General Purpose, 0603, 22uF, X5R, 15%, 20%, 10V; Tolerance: 20%; Weight: 0.000222oz; Material: Ceramic; Depth: 0.8mm; Length: 1.6mm; Termination: SMD/SMT; Capacitance: 22uF; Packaging: Tape and Reel; Width: 0.8mm; Voltage Rating: 10V; Case Code (Imperial): 0603; Mount: Surface Mount; Voltage Rating (DC): 10V; Case/Package: 0603; Thickness: 0.039inch; REACH SVHC: No SVHC; Dielectric: X5R; Height: 0.8mm; Package Quantity: 4000; Case Code (Metric): 1608; Min Operating Temperature: -55°C; Lead Free: Lead Free; Max Operating Temperature: 85°C
D3 D7 D9 = CMP-22017-000005-2: as D4 on sheet 14-DPLL_1; Min Operating Temperature: -55°C; Lens Style: Clear; Mount: Surface Mount; Width: 0.8mm; Packaging: Tape and Reel; Lens Transparency: Clear; Case Code (Metric): 1608; Depth: 0.8mm; Case Code (Imperial): 0603; Case/Package: 0603; Number of Pins: 2; Max Operating Temperature: 85°C; Lead Free: Lead Free; Number of Elements: 1; Length: 1.6mm; Height: 0.8mm; Package Quantity: 1; Power Rating: 100mW; Radiation Hardening: No; Illumination Color: Green; Color: Green
L9 L10 = CMP-06042-015149-1: Shielded Wirewound Inductor 0.47uH 20% 4000mA 0.027Ω 1008 (2520)
Q1 Q2 = CMP-1058-00779-1: as Q4 on sheet 16-ECP5_FPGA_1; ComponentLink3URL: http://www.onsemi.cn/pub_link/Collateral/318-08.PDF; Configuration: Single; PackageDescription: 3-Pin Small Outline Transistor, Body 2.92 x 1.3 mm, Pitch 0.95 mm; Packing: Tape and Reel; PartNumber: MVGSF1N03LT1G; ComponentLink2URL: http://www.onsemi.cn/pub_link/Collateral/MGSF1N03LT1-D.PDF; PackageVersion: Rev. AP, 11/2009; ComponentLink3Description: Package Specification; Package Type: SOT-23-3; ComponentLink1Description: Manufacturer URL; DatasheetVersion: Rev. 10; PackageReference: SOT-23-3-318-08; ComponentLink2Description: Datasheet; ComponentLink1URL: http://www.onsemi.com/; RoHS: Pb-Free; Mounting Technology: Surface Mount
R21 = CMP-1011-00663-2: Part Number: CRCW040223K7FKED; Manufacturer: Vishay Dale
R27 R28 R79 R80 R97 = CMP-2002-06457-1: as R137-R141 on sheet 13-ESP32C6
R53 R54 = CMP-2002-04694-1: as R135 on sheet 13-ESP32C6
R55 R73 R113 = CMP-2002-05853-1: as R182 on sheet 14-DPLL_1
R56 = CMP-2002-00511-1: Part Number: ERJ-2GEJ303X; Manufacturer: Panasonic
R58 = CMP-2002-07676-1: Part Number: RC0402FR-0740K2L; Manufacturer: Yageo / Phycomp
R72 = CMP-2002-07812-1: Part Number: RC0402FR-0780K6L; Manufacturer: Yageo / Phycomp
R98 = CMP-2002-00253-3: Chip Resistor, 8.06 KOhm, +/- 1%, 63 mW, -55 to 155 degC, 0402 (1005 Metric), RoHS, Tape and Reel; PartNumber: CRCW04028K06FKED; Manufacturer: Basic Passives; Case\/Package: 0402; Power Rating: 63 mW; Voltage Rating: 50 V; PackageReference: 0402; Radiation Hardening: No; Package Quantity: 10000; Height: 0.35 mm; Packaging: Tape and Reel; Mount: Surface Mount; Length: 1 mm; Weight: 2.3E-05oz; Case Code (Metric): 1005; DatasheetVersion: 06/2012; Pins: 2; Min Operating Temperature: -55 degC; Case Code (Imperial): 0402; REACH SVHC: Unknown; Tolerance: 1%; Mounting Technology: Surface Mount; ComponentLink1URL: http://www.vishay.com/; ComponentLink2URL: http://www.vishay.com/docs/20035/dcrcwe3.pdf; ComponentLink2Description: Datasheet; Resistance: 8.06 KOhm; Max Operating Temperature: 155 degC; ComponentLink1Description: Manufacturer URL; Width: 0.5 mm; RoHSCompliant: true; PackageDescription: 2-Pin Surface Mount Device, Body 1 x 0.5 mm
U8 = TPSM863253RDXR: No Description Available; Mfr_Name: Texas Instruments; TYPE: TYPE; RefDes: RefDes
U14 = CMP-04918-000654-1: Adjustable-Frequency Dual Step-Down Converter, 2.7-6V VIN, 0.6-5.5V 2A VOUT, VQFN-HR14

## Sheet 12-FPGA_Power.SchDoc
size B; SheetNumber: 14; SheetTotal: 14
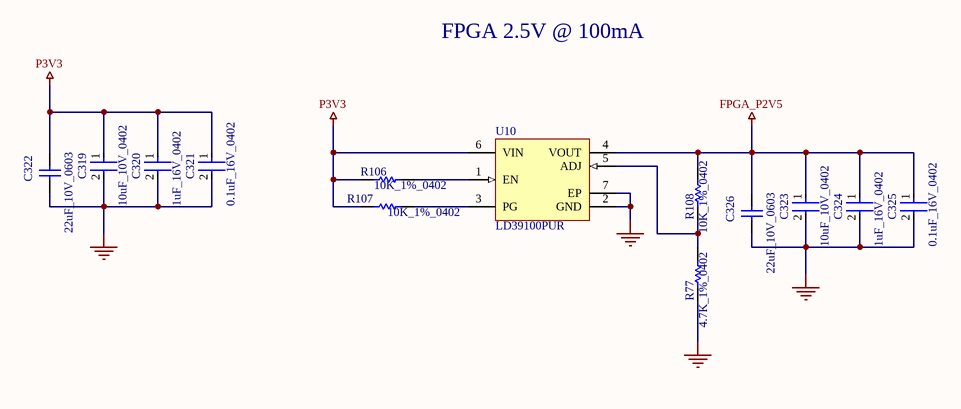
[diagram p13: 12-FPGA_Power.SchDoc]

### Parts
C319  10uF_10V_0402  [FP-CL05A106MP5NUNC-MFG]
C320  1uF_16V_0402  [FP-0402-L_1_0_0_05-W_0_5-IPC_A]
C321  0.1uF_16V_0402  [FP-C0402-BB-MFG]
C322  22uF_10V_0603  [CAPC1608X100X20ML10]
C323  10uF_10V_0402  [FP-CL05A106MP5NUNC-MFG]
C324  1uF_16V_0402  [FP-0402-L_1_0_0_05-W_0_5-IPC_A]
C325  0.1uF_16V_0402  [FP-C0402-BB-MFG]
C326  22uF_10V_0603  [CAPC1608X100X20ML10]
R77  4.7K_1%_0402  [RESC1005X40X25NL10T10]
R106  10K_1%_0402  [RESC1005X40X25NL10T10]
R107  10K_1%_0402  [RESC1005X40X25NL10T10]
R108  10K_1%_0402  [RESC1005X40X25NL10T10]
U10  LD39100PUR  [DFN6D_M]

### Nets
FPGA_P2V5: C323.1 C324.1 C325.1 C326.2 R108.2 U10.4(VOUT)
GND: C319.2 C320.2 C321.2 C322.1 C323.2 C324.2 C325.2 C326.1 R77.1 U10.2(GND) U10.7(EP)
P3V3: C319.1 C320.1 C321.1 C322.2 R106.2 R107.2 U10.6(VIN)
NetR77_2: R77.2 R108.1 U10.5(ADJ)
NetR106_1: R106.1 U10.1(EN)
NetR107_1: R107.1 U10.3(PG)

### Notes on the sheet
- FPGA 2.5V @ 100mA

### Library data of the parts
C319 C323 = CMP-13271-000002-1: as C7 on sheet 14-DPLL_1; Octopart: https://octopart.com/cl05a106mp5nunc-samsung-22457395; Voltage Rating: 10V; RoHS: TRUE; Value: 10uF; Height: 0.7mm; Digikey Description: CAP CER 10UF 10V X5R 0402; Automotive: No; Package: CL05A106MP5NUNC; Device Class L1: Passive Components; Capacitance: 10uF; Temperature Range High: +85°C; ComponentLink2Description: Datasheet; Device Class L2: Capacitors; Temperature Characteristic: X5R; Temperature: -55°C to +85°C; ComponentLink2URL: http://www.samsungsem.com/kr/support/product-search/mlcc/__icsFiles/afieldfile/2019/05/10/19-CL05A106MP5NUNC.pdf; Device Class L3: Ceramic Capacitors; Category: Cap; Temperature Range Low: -55°C; Ipc Land Pattern Name: CAPC10050X50; Lead Free: Yes
C320 C324 = CMP-14477-000104-2: as C301 on sheet 13-ESP32C6; Packaging: Tape and Reel; Depth: 0.5mm; Mount: Surface Mount; Thickness: 0.022inch; Package Quantity: 1; Min Operating Temperature: -55°C; Series: M; Voltage Rating (DC): 16V; Termination: SMD/SMT; Case/Package: 0402; Number of Pins: 2; Case Code (Imperial): 0402; Length: 1mm; Halogen Free: Halogen Free; Case Code (Metric): 1005; Width: 0.02inch; RoHS Compliant: Yes; Radiation Hardening: No; Max Operating Temperature: 85°C; Height: 0.5mm; Construction: Flat
C321 C325 = CMP-1034-02068-3: as C300 on sheet 13-ESP32C6; ComponentLink2URL: https://content.kemet.com/datasheets/KEM_C1002_X7R_SMD.pdf; Automotive: No; Device Class L2: Capacitors; Temperature: -55°C to +125°C; RoHS: TRUE; Voltage Rating: 16 V; ComponentLink2Description: Datasheet; Device Class L3: Ceramic Capacitors; Temperature Range Low: -55°C; Ipc Land Pattern Name: CAPC10050X50; Device Class L1: Passive Components; Temperature Range High: +125°C; Package: C0402-BB; Capacitance: 0.10 μF; Category: Cap; Mouser Description: CAP CER 0.1UF 16V X7R 0402; Height: 0.55mm; Digikey Description: CAP CER 0.1UF 16V 5% X7R 0402; Octopart: https://octopart.com/c0402c104j4ractu-kemet-12573893; Temperature Characteristic: X7R; Lead Free: Yes
C322 C326 = CMP-2000-05441-1: as C38 on sheet 11-Power; Packaging: CutTape(CT); Standard Package: 1; Package / Case: 0603(1608Metric); Lead Style: -; Features: -; Ratings: -; Operating Temperature: -55degC~85degC; Applications: GeneralPurpose; Package Reference: 603; Datasheet URL: http://download.siliconexpert.com/pdfs/2015/4/21/15/54/45/779/tdk_/manual/37024850441143360mlcc_commercial_general_en.pdf; Datasheet Version: Mar-15; Mounting Type: SurfaceMount,MLCC; Lead Spacing: -; Size / Dimension: 0.063"Lx0.031"W(1.60mmx0.80mm); Height - Seated (Max): -; Package Description: 2-Pin Surface Mount Device, Body 1.6 x 0.8 mm; Manufacturer URL: http://www.tdk.com/; RoHS Information: RoHSCertificate-MLCC; Tolerance: ±20%; Series: C; Thickness (Max): 0.035"(0.90mm); Family: CeramicCapacitors; Category: Capacitors
R77 = CMP-2002-05217-1: as R16 on sheet 14-DPLL_1
R106-R108 = CMP-2002-04694-1: as R135 on sheet 13-ESP32C6
U10 = CMP-0244-00287-1: 1 A Low Quiescent Current Low Noise Voltage Regulator, Adjustable from 0.8V, 6-Pin VFDFPN, Tape and Reel; ComponentLink1URL: http://www.st.com; ComponentLink1Description: Manufacturer URL; ComponentLink2Description: Datasheet; DatasheetVersion: 1/10/2011; PackageDescription: 6-Pin Plastic, Dual LLP, 3 x 3 mm Body, 0.95 mm Pitch, Exposed Pad; PackageReference: DFN6D; ComponentLink2URL: http://www.st.com/internet/com/TECHNICAL_RESOURCES/TECHNICAL_LITERATURE/DATASHEET/CD00233788.pdf; PackageVersion: 2008